# EasyEDA schematic SCH_ECE198-04.json
TITLE: Automatic-Garden; REV: 0.4; Date: 2022-10-26; Sheet: 1/1; Drawn By: Damir Gazizullin; Company: University of Waterloo
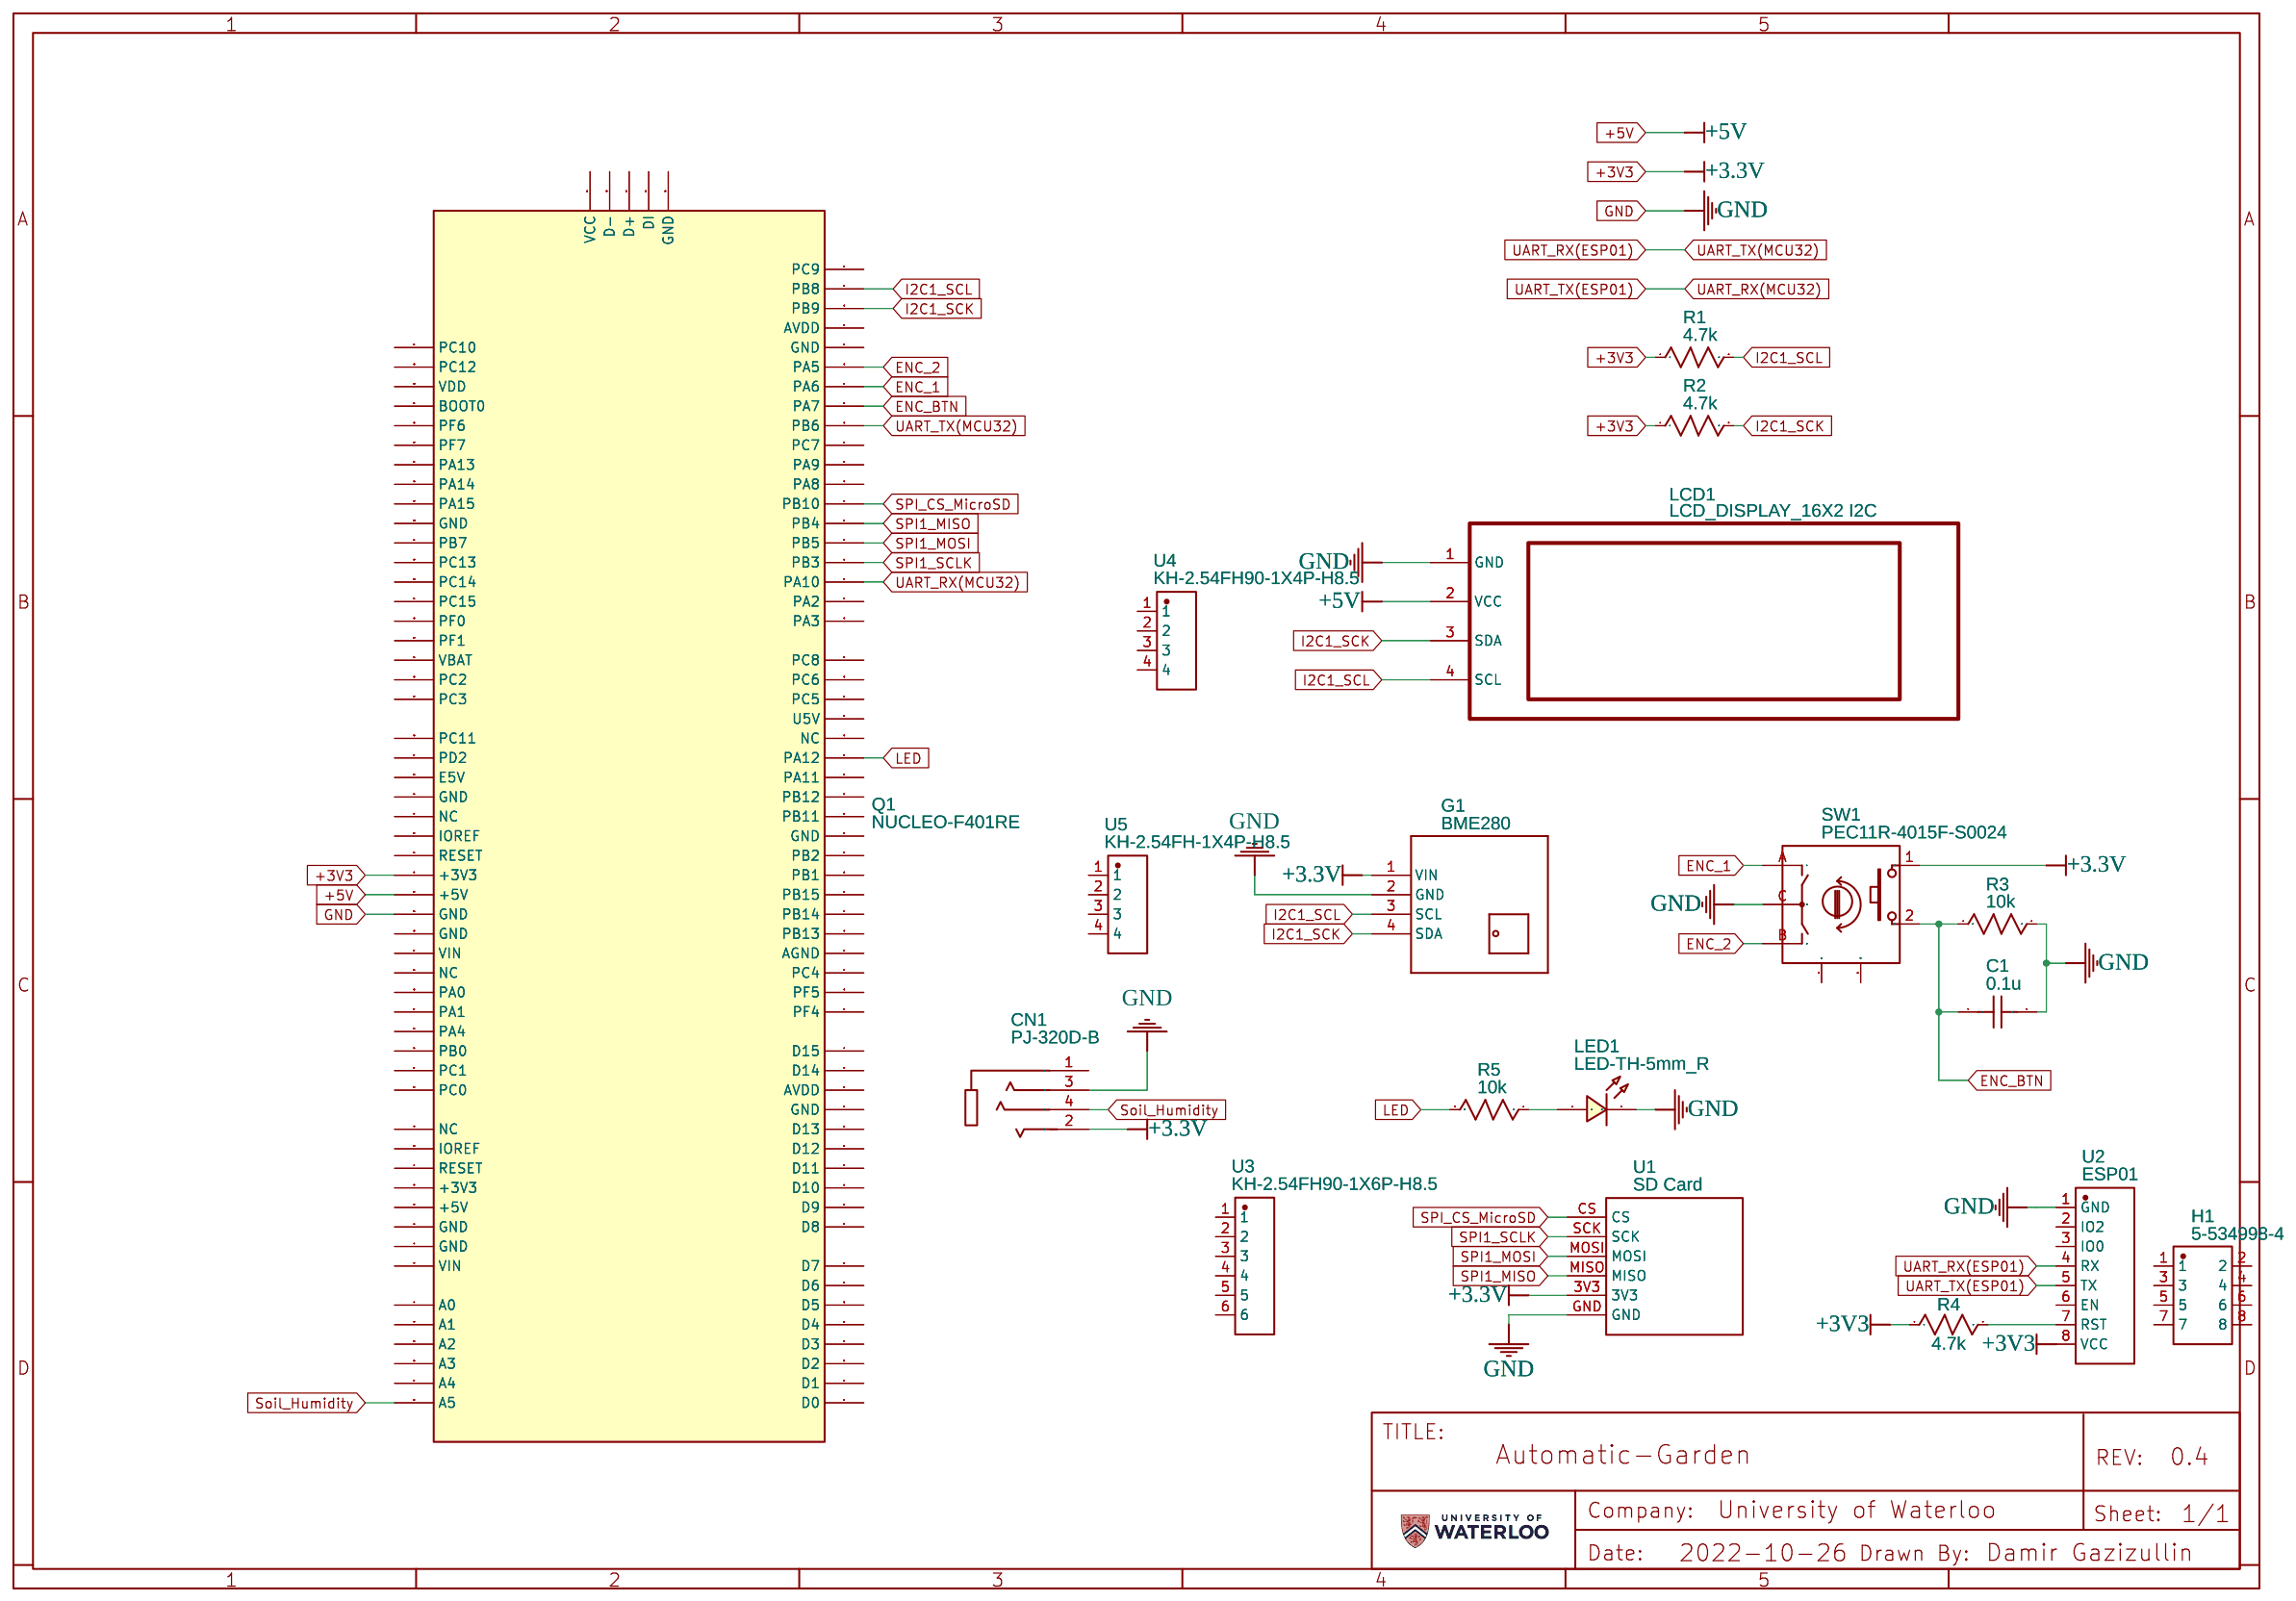
[diagram p0: schematic sheet]

## Parts
C1  0.1u  [C0603]
CN1  PJ-320D-B  [AUDIO-SMD_XKB_PJ-320D-B]
G1  BME280  [TEMP-HUM-PRES-BME280]
H1  5-534998-4  [HDR-TH_8P-P2.54-V-R2-C4-S2.54_A2541WV-2X4P]
LCD1  LCD_DISPLAY_16X2 I2C  [LCD_2004_4-8BIT_IF LCD_2004_4-8BIT_IF V4 I2C]
LED1  LED-TH-5mm_R  [LED-TH_BD5.0_RED]
Q1  NUCLEO-F401RE  [ARDUINOR3-NOTEXT-NOIOREF]
R1  4.7k  [R0603]
R2  4.7k  [R0603]
R3  10k  [R_AXIAL-0.5]
R4  4.7k  [R_AXIAL-0.5]
R5  10k  [R_AXIAL-0.5]
SW1  PEC11R-4015F-S0024  [SW-TH_PEC11R-4XXXF-SXXXX]
U1  SD Card  [SD CARD]
U2  ESP01  [ESP01]
U3  KH-2.54FH90-1X6P-H8.5  [HDR-TH_6P-P2.54-H-F-W10.0-N]
U4  KH-2.54FH90-1X4P-H8.5  [HDR-TH_4P-P2.54-H-F-W10.2]
U5  KH-2.54FH-1X4P-H8.5  [HDR-TH_4P-P2.54-V-F]

## Library data of the parts
C1 = C_0603_US: Contributor: LCEDA_Lib
CN1 = PJ-320D-B: Supplier: LCSC; Supplier Part: C2884940; Manufacturer: XKB Connectivity(中国星坤); Contributor: LCSC; JLCPCB Part Class: Extended Part
G1 = TEMP-HUM-PRES-BME280: Contributor: Azias
H1 = 5-534998-4: Supplier: LCSC; Supplier Part: C404201; Manufacturer: TE Connectivity; Contributor: LCSC; JLCPCB Part Class: Extended Part
LCD1 = LCD_DISPLAY_16X2 I2C: sourceId: yDLFXRL3l; 15: A; Contributor: trailescu andreea
LED1 = LED-TH-5mm_R: Manufacturer: EVERLIGHT(台湾亿光); Manufacturer Part: 333-2SURD/S530-A3; Supplier Part: C87271; Supplier: LCSC; Contributor: LCEDA_Lib
Q1 = NUCLEO-F401RE
R1 R2 = R_0603_US: Contributor: LCEDA_Lib
R3-R5 = R_AXIAL-0.5_US: Contributor: LCEDA_Lib
SW1 = PEC11R-4015F-S0024: Supplier: LCSC; Supplier Part: C143789; Manufacturer: BOURNS; Contributor: LCSC; JLCPCB Part Class: Extended Part
U1 = SD Card: Contributor: Дамир Газизуллин
U2 = ESP01: Contributor: luisfbarba
U3 = KH-2.54FH90-1X6P-H8.5: Supplier: LCSC; Supplier Part: C2932681; Manufacturer: kinghelm(金航标); Contributor: LCSC; JLCPCB Part Class: Extended Part
U4 = KH-2.54FH90-1X4P-H8.5: Supplier: LCSC; Supplier Part: C2932680; Manufacturer: kinghelm(金航标); Contributor: LCSC; JLCPCB Part Class: Extended Part
U5 = KH-2.54FH-1X4P-H8.5: Supplier: LCSC; Supplier Part: C2905415; Manufacturer: kinghelm(金航标); Contributor: LCSC; JLCPCB Part Class: Extended Part

## Nets
+3.3V: CN1.2 G1.1(VIN) Q1.91(+3V3) R1.1 R2.1 R4.1 SW1.1 U1.3V3 U2.8(VCC)
+5V: LCD1.2(VCC) Q1.90(+5V)
GND: C1.2 CN1.3 G1.2(GND) LCD1.1(GND) LED1.2 Q1.89(GND) R3.2 SW1.C U1.GND U2.1(GND)
ENC_1: Q1.14(PA6) SW1.A
ENC_2: Q1.13(PA5) SW1.B
ENC_BTN: C1.1 Q1.15(PA7) R3.1 SW1.2
I2C1_SCK: G1.4(SDA) LCD1.3(SDA) Q1.10(PB9) R2.2
I2C1_SCL: G1.3(SCL) LCD1.4(SCL) Q1.9(PB8) R1.2
LED: Q1.33(PA12) R5.2
Soil_Humidity: CN1.4 Q1.66(A5)
SPI1_MISO: Q1.21(PB4) U1.MISO
SPI1_MOSI: Q1.22(PB5) U1.MOSI
SPI1_SCLK: Q1.23(PB3) U1.SCK
SPI_CS_MicroSD: Q1.20(PB10) U1.CS
UART_RX(ESP01): Q1.16(PB6) U2.4(RX)
UART_RX(MCU32): Q1.24(PA10) U2.5(TX)
Net-(LED1-1): LED1.1 R5.1
Net-(R4-2): R4.2 U2.7(RST)

Not connected (* = marked no-connect by the designer): CN1 1; H1 1 2 3 4 5 6 7 8; Q1 8(PC9) 11(AVDD) 12(GND) 17(PC7) 18(PA9) 19(PA8) 25(PA2) 26(PA3) 28(PC8) 29(PC6) 30(PC5) 31(U5V) 32(NC) 34(PA11) 35(PB12) 36(PB11) 37(GND) 38(PB2) 39(PB1) 40(PB15) 41(PB14) 42(PB13) 43(AGND) 44(PC4) 45(PF5) 46(PF4) 47(D15) 48(D14) 49(AVDD) 50(GND) 51(D13) 52(D12) 53(D11) 54(D10) 55(D9) 56(D8) 58(D7) 59(D6) 60(D5) 61(D4) 62(D3) 63(D2) 64(D1) 65(D0) 67(A4) 68(A3) 69(A2) 70(A1) 71(A0) 72(VIN) 73(GND) 74(GND) 75(+5V) 76(+3V3) 77(RESET) 78(IOREF) 79(NC) 80(PC0) 81(PC1) 82(PB0) 83(PA4) 84(PA1) 85(PA0) 86(NC) 87(VIN) 88(GND) 92(RESET) 93(IOREF) 94(NC) 95(GND) 96(E5V) 97(PD2) 98(PC11) 99(PC3) 100(PC2) 101(VBAT) 102(PF1) 103(PF0) 104(PC15) 105(PC14) 106(PC13) 107(PB7) 108(GND) 109(PA15) 110(PA14) 111(PA13) 112(PF7) 113(PF6) 114(BOOT0) 115(VDD) 116(PC12) 117(PC10) 118(GND); SW1 MT1 MT2; U2 2(IO2) 3(IO0) 6(EN); U3 1 2 3 4 5 6; U4 1 2 3 4; U5 1 2 3 4
